# Altium schematic sheet Power - 3V3.SchDoc
size A4
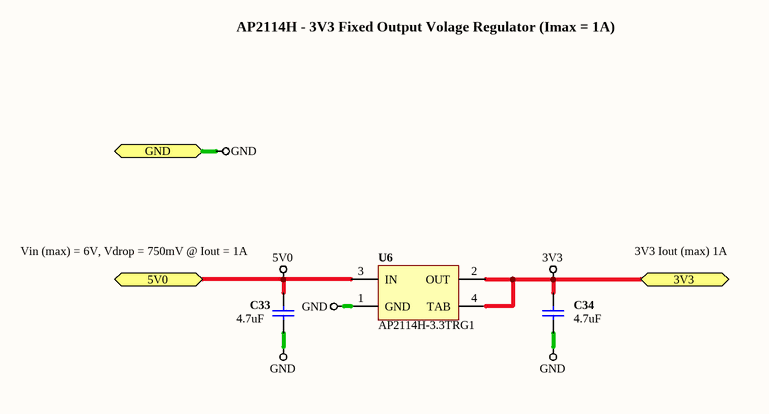
[diagram p0: Power - 3V3.SchDoc]

## Parts
C33  value 4.7uF  [CAPC0603(1608)55_L]  (hidden comment: CAP 4.7uF 10V 0603(1608))
C34  value 4.7uF  [CAPC0603(1608)55_L]  (hidden comment: CAP 4.7uF 10V 0603(1608))
U6  AP2114H-3.3TRG1  [SOT230P700X180-4L]

## Ports
3V3, 5V0, GND

## Nets
3V3: C34.1 U6.2(OUT) U6.4(TAB) ; port 3V3
5V0: C33.1 U6.3(IN) ; port 5V0
GND: C33.2 C34.2 U6.1(GND) ; port GND

## Notes on the sheet
- AP2114H - 3V3 Fixed Output Volage Regulator (Imax = 1A)
- (near C33) Vin (max) = 6V, Vdrop = 750mV @ Iout = 1A
- 3V3 Iout (max) 1A

## Library data of the parts
C33 C34 = CAP 4.7uF 10V ±10% 0603 (1608 Metric) Thickness 0.55mm SMD: Case-Metric: 1608; Case-EIA: 0603; Tolerance: ±10%; Rated Voltage: 10 V; Technology: SMT; Max Thickness: 0.55 mm
U6 = AP2114H-3.3TRG1: AP2114, 1A Low Dropout Positive Fixed 3V3 Regulator; Max Input Voltage: 6V; Max Output Voltage: 3.34V; Min Input Voltage: -0.3V; Min Output Voltage: 3.25V; Supply Voltage: 5V; Max Output Current: 1A; Mounting Technology: Surface Mount; Status: Unreleased; Temperature Range: -40 - 125 degC; Category: IC-Power